# Altium schematic sheet ALARM.SchDoc
size A
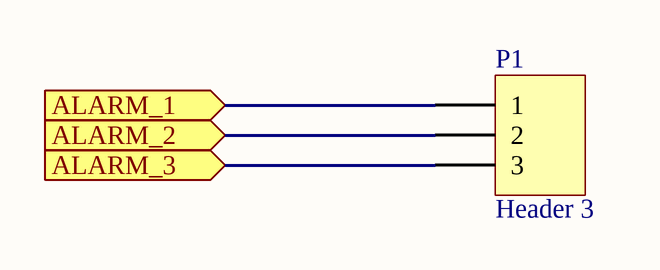
[diagram p0: ALARM.SchDoc]

## Parts
P1  Header 3  [HDR1X3]  (no BOM)

## Ports
ALARM_1 (in), ALARM_2 (in), ALARM_3 (in)

## Nets
ALARM_1: P1.1 ; port ALARM_1
ALARM_2: P1.2 ; port ALARM_2
ALARM_3: P1.3 ; port ALARM_3

## Library data of the parts
P1 = Header 3: Header, 3-Pin; LatestRevisionDate: 17-Jul-2002; LatestRevisionNote: Re-released for DXP Platform.; Publisher: Altium Limited